# Altium project SLRC_Robot.PrjPcb (part 2 of 2)

## Sheet BuckBoost.SchDoc
size A; SheetNumber: 9; SheetTotal: 11
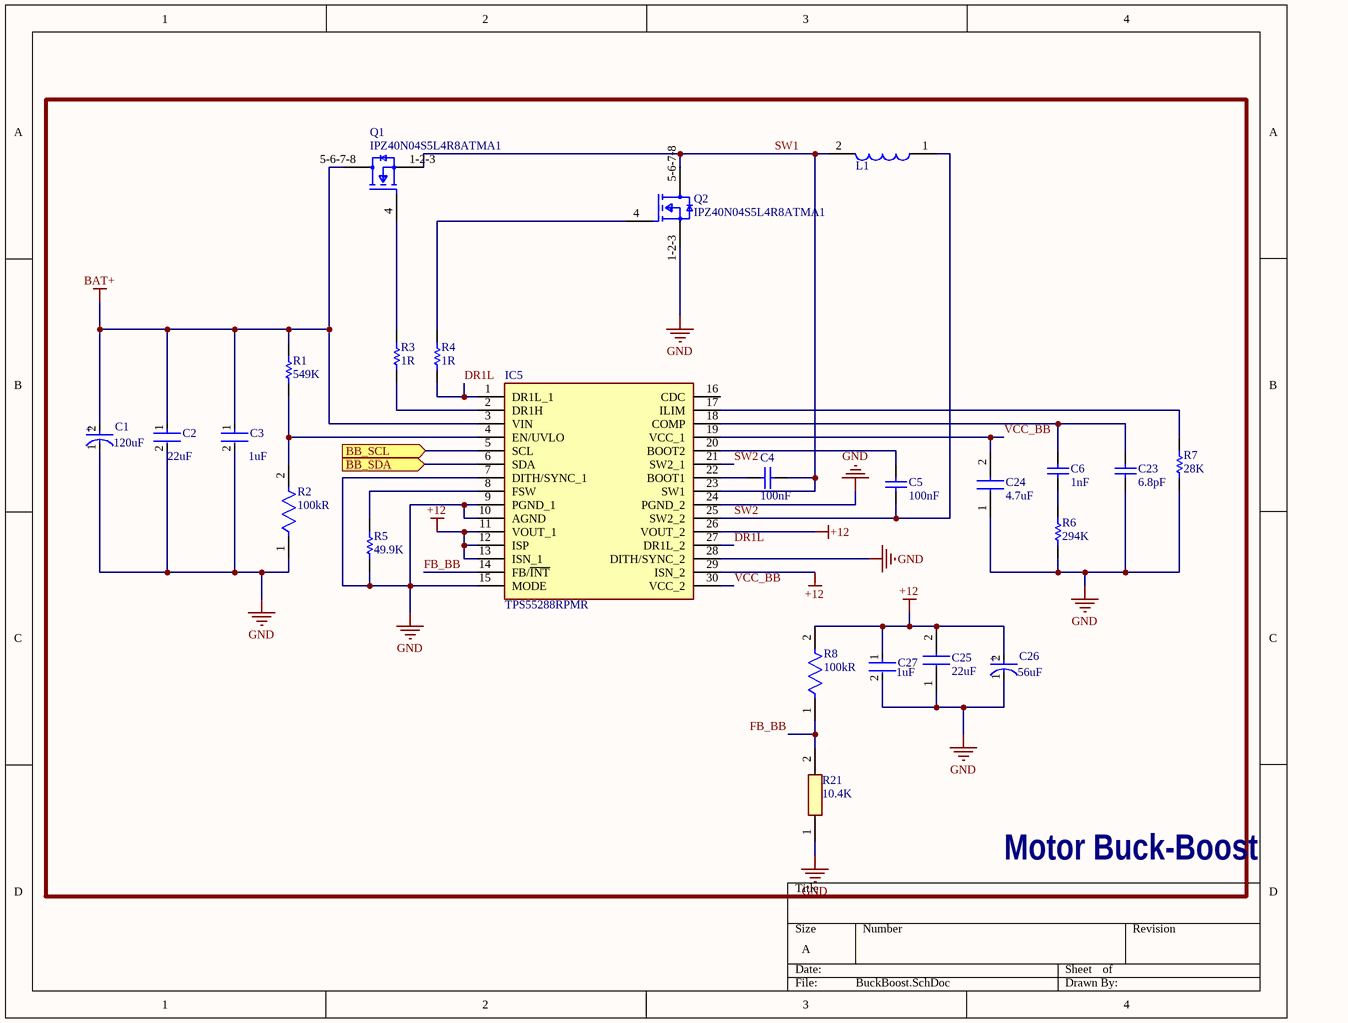
[diagram p10: BuckBoost.SchDoc]

### Parts
C1  Capacitance: 120uF  [FP-OS-CON-SMT-C6-MFG]  (hidden comment: 20SVPF120M)
C2  Capacitance: 22uF  [FP-GRM32-MFG]  (hidden comment: GRM32ER61E226KE15L)
C3  Capacitance: 1uF  [FP-C1005-050-0_05-IPC_C]  (hidden comment: C1005X5R1V105K050BC)
C4  Capacitance: 100nF  [CAPC1050X55X23ML05T13]  (hidden comment: CL05B104KO5NNNC)
C5  Capacitance: 100nF  [CAPC1050X55X23ML05T13]  (hidden comment: CL05B104KO5NNNC)
C6  capacitance: 1nF  [CAPC1005X55X25NL05T10]  (hidden comment: GRM155R71C102KA01D)
C23  capacitance: 6.8pF  [CAPC1005X55X25NL05T10]  (hidden comment: GRM1555C1E6R8CA01D)
C24  capacitance: 4.7uF  [CAPC1608X80N]  (hidden comment: C1608X6S1C475K080AC)
C25  capacitance: 22uF  [CAPC5750X280N]  (hidden comment: CGA9P2X7R1E226M250KA)
C26  Capacitance: 56uF  [FP-OS-CON-SMT-B6-MFG]  (hidden comment: 20SVPF56MX)
C27  Capacitance: 1uF  [FP-C1005-050-0_05-IPC_C]  (hidden comment: C1005X5R1V105K050BC)
IC5  TPS55288RPMR  [TPS55288RPMR]
L1  XAL6030-182MEB  [XAL6030182MEB]  (value not drawn)
Q1  IPZ40N04S5L4R8ATMA1  [FP-PG-TSDSON-8-MFG]
Q2  IPZ40N04S5L4R8ATMA1  [FP-PG-TSDSON-8-MFG]
R1  resistance: 549K  [RESC1005X40X25LL05T05]  (hidden comment: CRCW0402549KFKED)
R2  Resistance: 100kR  [FP-CRCW0402-e3-IPC_C]  (hidden comment: CRCW0402100KFKED)
R3  resistance: 1R  [RESC1609X50X30NL10T20]  (hidden comment: CRCW06031R00FKEA)
R4  resistance: 1R  [RESC1609X50X30NL10T20]  (hidden comment: CRCW06031R00FKEA)
R5  resistance: 49.9K  [RESC1005X40X25LL05T05]  (hidden comment: CRCW040249K9FKED)
R6  resistance: 294K  [RESC1005X40X25LL05T05]  (hidden comment: CRCW0402294KFKED)
R7  resistance: 28K  [RESC1005X40X25NL05T05]  (hidden comment: CRCW040228K0FKED)
R8  Resistance: 100kR  [FP-CRCW0402-e3-IPC_C]  (hidden comment: CRCW0402100KFKED)
R21  resistance: 10.4K  [RESC2012X60N]  (hidden comment: RT0805BRD0710K4L)

### Blocks framed on the sheet
Motor Buck-Boost: C1-C6 C23-C27 IC5 L1 Q1 Q2 R1-R8 R21

### Ports
BB_SCL (in, see Power[2A]), BB_SDA (in, see Power[2A])

### Nets
+12: C25.2 C26.2(A) C27.1 IC5.11(VOUT_1) IC5.12(ISP) IC5.13(ISN_1) IC5.26(VOUT_2) IC5.29(ISN_2) R8.2
BAT+: C1.2(A) C2.1 C3.1 IC5.3(VIN) Q1.5-6-7-8(D) R1.2
GND: C1.1(C) C2.2 C3.2 C23.1 C24.1 C25.1 C26.1(C) C27.2 IC5.7(DITH/SYNC_1) IC5.9(PGND_1) IC5.10(AGND) IC5.15(MODE) IC5.24(PGND_2) IC5.28(DITH/SYNC_2) Q2.1-2-3(S) R2.1 R5.1 R6.1 R7.1 R21.1
DR1L: IC5.1(DR1L_1) IC5.27(DR1L_2) R4.1
FB_BB: IC5.14(FB/~{INT}) R8.1 R21.2
MCU_SCL_1: IC5.5(SCL) ; port BB_SCL
MCU_SDA_1: IC5.6(SDA) ; port BB_SDA
SW1: C4.1 IC5.23(SW1) L1.2 Q1.1-2-3(S) Q2.5-6-7-8(D)
SW2: C5.2 IC5.21(SW2_1) IC5.25(SW2_2) L1.1
VCC_BB: C24.2 IC5.19(VCC_1) IC5.30(VCC_2)
NetC4_2: C4.2 IC5.22(BOOT1)
NetC5_1: C5.1 IC5.20(BOOT2)
NetC6_1: C6.1 R6.2
NetC6_2: C6.2 C23.2 IC5.18(COMP)
NetIC5_2: IC5.2(DR1H) R3.1
NetIC5_4: IC5.4(EN/UVLO) R1.1 R2.2
NetIC5_8: IC5.8(FSW) R5.2
NetIC5_17: IC5.17(ILIM) R7.2
NetQ1_4: Q1.4(G) R3.2
NetQ2_4: Q2.4(G) R4.2

Not connected (* = marked no-connect by the designer): IC5 16(CDC)

### Notes on the sheet
- (in symbol CMP-05428-001086-1) +
- (in symbol CMP-05428-001333-1) +

### Library data of the parts
C1 = CMP-05428-001333-1: Conductive Polymer Aluminum Solid Capacitors (OS-CON) 120uF ±20% 20V; Polarity: Polar; ESR (Equivalent Series Resistance): 25mR; Leakage Current: 480uA; Ripple Current: 3.2A; Life (Hours): 5000Hour; Dissipation Factor: 12%; Lead Free: Lead Free; Voltage Rating: 20V; Packaging: Tape and Reel; Min Operating Temperature: -55°C; Tolerance: 20%; Diameter: 6.3mm; Max Operating Temperature: 105°C; Length: 5.9mm; Termination: SMD/SMT; Height - Seated (Max): 0.236inch; REACH SVHC: No SVHC; Voltage Rating (DC): 20V; Voltage: 20V; Material: Polymer; Ripple Current (AC): 3.2A; Series: OS-CON™, SVPF; RoHS Compliant: Yes; Mount: Surface Mount; Height: 5.9mm; Package Quantity: 1000; Radiation Hardening: No; Construction: Cylindrical; Case/Package: Radial; Number of Pins: 6
C2 = CMP-2000-05458-2: CAP CER 22UF 25V X5R 1210; Manufacturer: Murata Electronics North America; Possible Substitute: GRM32ER61E226KE15K; Other Names: 490-3889-2; Material: Ceramic; Tolerance: 10%; Digikey Description: CAP CER 22UF 25V X5R 1210; Mouser Description: Multilayer Ceramic Capacitors MLCC - SMD/SMT 1210 22uF 25volts X5R 10%; Device Class L2: Capacitors; Height: 2.7mm; Temperature Characteristic: X5R; Category: Cap; RoHS: TRUE; Operating Temperature: -55°C ~ 85°C; Temperature: -55°C to +85°C; Lead Free: Yes; Package: GRM32; Temperature Range High: +85°C; Package / Case: 1210 (3225 Metric); Standard Package: 1,000; Packaging: Cut Tape (CT); Thickness (Max): 0.106" (2.70mm); Value: 22uF; Automotive: No; Device Class L1: Passive Components; Voltage - Rated: 25V; Temperature Range Low: -55°C; Size / Dimension: 0.126" L x 0.098" W (3.20mm x 2.50mm); ComponentLink2Description: Datasheet; Device Class L3: Ceramic Capacitors; Temperature Coefficient: X5R; ComponentLink2URL: https://search.murata.co.jp/Ceramy/image/img/A01X/G101/ENG/GRM32ER61E226KE15-01A.pdf; Voltage Rating: 25V; Manufacturer Part Number: GRM32ER61E226KE15L; Octopart: https://octopart.com/grm32er61e226ke15l-murata-197441; Applications: General Purpose; Mounting Type: Surface Mount, MLCC
C3 C27 = CMP-2000-06004-2: Multilayer Ceramic Capacitors 1μF ±10% 35V X5R SMD 0402; Series: C; Voltage Rating (DC): 35V; Max Operating Temperature: 85°C; Resistor Type: Ceramic; REACH SVHC: No SVHC; Package Quantity: 1; Packaging: Tape and Reel; Termination: SMD/SMT; Dielectric Material: Ceramic; Height: 0.5mm; Length: 1mm; Min Operating Temperature: -55°C; Dielectric: X5R; Thickness: 0.022inch; Lead Free: Lead Free; Voltage Rating: 35V; Width: 0.02inch; Depth: 0.5mm; Case Code (Imperial): 0402; Case/Package: 0402; Tolerance: 10%; Weight: 2.3E-05oz; Radiation Hardening: No; RoHS Compliant: Yes; Case Code (Metric): 1005; Mount: Surface Mount
C4 C5 = CMP-2000-05439-1: Chip Capacitor, 100 nF, +/- 10%, 16 V, -55 to 125 degC, 0402 (1005 Metric), RoHS, Tape and Reel; Manufacturer: Samsung Electro-Mechanics; Dielectric: X7R; Rated Voltage: 16V; Case Size/Dimension: 0402; Tolerance (%): ±10%; Manufacturer URL: http://www.samsungsem.com/global/index.jsp; Datasheet URL: https://datasheet.ciiva.com/29198/458718-da-01-en-vs-kondensator-0402-29198423.pdf; Datasheet Version: Nov-10
C6 = CMP-2008-03949-1: Manufacturer: Murata; Part Number: GRM155R71C102KA01D
C23 = CMP-2008-04219-1: Manufacturer: Murata; Part Number: GRM1555C1E6R8CA01D
C24 = C1608X6S1C475K080AC: Capacitor; Manufacturer_Name: TDK; Datasheet Link: https://product.tdk.com/info/en/catalog/datasheets/mlcc_commercial_midvoltage_en.pdf; Height: 0.8mm; Manufacturer_Part_Number: C1608X6S1C475K080AC; Mouser Part Number: 810-C1608X6S1C475K; Mouser Price/Stock: https://www.mouser.co.uk/ProductDetail/TDK/C1608X6S1C475K080AC?qs=dfay7wIA1uELNO4%252B8xvBDw%3D%3D; Arrow Part Number: C1608X6S1C475K080AC; Arrow Price/Stock: https://www.arrow.com/en/products/c1608x6s1c475k080ac/tdk?region=nac
C25 = CGA9P2X7R1E226M250KA: Capacitor; Manufacturer_Name: TDK; Datasheet Link: https://product.tdk.com/system/files/dam/doc/product/capacitor/ceramic/mlcc/catalog/mlcc_automotive_general_en.pdf; Height: 2.8mm; Manufacturer_Part_Number: CGA9P2X7R1E226M250KA; Mouser Part Number: 810-CGA9P2X7R1E226M; Mouser Price/Stock: https://www.mouser.co.uk/ProductDetail/TDK/CGA9P2X7R1E226M250KA?qs=NRhsANhppD99aYOe83Ouyg%3D%3D; Arrow Part Number: CGA9P2X7R1E226M250KA; Arrow Price/Stock: https://www.arrow.com/en/products/cga9p2x7r1e226m250ka/tdk?region=nac
C26 = CMP-05428-001086-1: Conductive Polymer Aluminum Solid Capacitors (OS-CON) 56uF ±20% 20V; Ripple Current (AC): 2.8A; Polarity: Polar; ESR (Equivalent Series Resistance): 30mR; Life (Hours): 5000Hour; Dissipation Factor: 12%; Leakage Current: 224uA; Case/Package: Radial; Mount: Surface Mount; Tolerance: 20%; Termination: SMD/SMT; Length: 5.9mm; RoHS Compliant: Yes; Height - Seated (Max): 0.236inch; Ripple Current: 2.8A; Voltage Rating (DC): 20V; Packaging: Tape and Reel; REACH SVHC: No SVHC; Voltage: 20V; Min Operating Temperature: -55°C; Height: 5.9mm; Series: OS-CON™, SVPF; Package Quantity: 1500; Max Operating Temperature: 105°C; Voltage Rating: 20V; Diameter: 5mm; Number of Pins: 6
IC5 = TPS55288RPMR: Integrated Circuit; Manufacturer_Name: Texas Instruments; Datasheet Link: https://www.ti.com/lit/ds/symlink/tps55288.pdf; Height: 1mm; Manufacturer_Part_Number: TPS55288RPMR; Mouser Part Number: 595-TPS55288RPMR; Mouser Price/Stock: https://www.mouser.co.uk/ProductDetail/Texas-Instruments/TPS55288RPMR?qs=bAKSY%2FctAC57bSsN8PUBnQ%3D%3D; Arrow Part Number: TPS55288RPMR; Arrow Price/Stock: https://www.arrow.com/en/products/tps55288rpmr/texas-instruments?region=nac
L1 = XAL6030-182MEB: Inductor; Manufacturer_Name: COILCRAFT; Datasheet Link: https://www.coilcraft.com/pdfs/xal60xx.pdf; Height: 3.1mm; Manufacturer_Part_Number: XAL6030-182MEB; Mouser Part Number: 994-XAL6030-182MEB; Mouser Price/Stock: https://www.mouser.co.uk/ProductDetail/Coilcraft/XAL6030-182MEB?qs=VJjuEbE9QBNl9%2F4O4ZhQvg%3D%3D
Q1 Q2 = CMP-32901-000690-1: MOSFET N-CH 40V 40A 8TSDSON; Max Power Dissipation: 48W; Rds On Max: 4.8mR; Input Capacitance: 1.56nF; Packaging: Tape and Reel; Max Operating Temperature: 175°C; Max Dual Supply Voltage: 40V; Min Operating Temperature: -55°C; Continuous Drain Current (ID): 40A; Number of Pins: 8; Halogen Free: Halogen Free; Lead Free: Contains Lead; Series: Automotive, AEC-Q101, OptiMOS™; Drain to Source Voltage (Vdss): 40V; RoHS Compliant: Yes; Mount: Surface Mount
R1 = CMP-2002-00092-1: Manufacturer: Vishay Dale; Part Number: CRCW0402549KFKED
R2 R8 = CMP-2002-08123-3: RES Thick Film, 100kΩ, 1%, 0.063W, 100ppm/°C, 0402; Power Rating: 63mW; Voltage Rating (DC): 50V; Lead Free: Lead Free; Height: 0.35mm; Contact Plating: Tin; Min Operating Temperature: -55°C; Package Quantity: 10000; Case/Package: 0402; Temperature Coefficient: 100ppm/°C; Number of Terminations: 2; Packaging: Tape and Reel; Max Power Dissipation: 63mW; Case Code (Metric): 1005; Mount: Surface Mount; Width: 0.02inch; Termination: SMD/SMT; Length: 1mm; Number of Pins: 2; Weight: 2.3E-05oz; Radiation Hardening: No; Tolerance: 1%; Military Standard: Not; Features: Automotive AEC-Q200; Depth: 0.5mm; Composition: Thick Film; Max Operating Temperature: 155°C; Voltage Rating: 50V; Case Code (Imperial): 0402
R3 R4 = CMP-1012-00171-2: Manufacturer: Vishay Dale; Part Number: CRCW06031R00FKEA
R5 = CMP-2002-00039-1: Manufacturer: Vishay Dale; Part Number: CRCW040249K9FKED
R6 = CMP-2002-08443-1: Manufacturer: Vishay Dale; Part Number: CRCW0402294KFKED
R7 = CMP-2002-08441-1: Manufacturer: Vishay Dale; Part Number: CRCW040228K0FKED
R21 = RT0805BRD0710K4L: Resistor; Manufacturer_Name: KEMET; Datasheet Link: https://www.arrow.com/en/products/rt0805brd0710k4l/yageo; Height: 0.6mm; Manufacturer_Part_Number: RT0805BRD0710K4L; Mouser Part Number: 603-RT0805BRD0710K4L; Mouser Price/Stock: https://www.mouser.co.uk/ProductDetail/Yageo/RT0805BRD0710K4L?qs=MIKj0bPR1zBRjPJ4x5pJ2A%3D%3D; Arrow Part Number: RT0805BRD0710K4L; Arrow Price/Stock: https://www.arrow.com/en/products/rt0805brd0710k4l/yageo

## Sheet 3.3V_LDO.SchDoc
size A; SheetNumber: 11; SheetTotal: 11
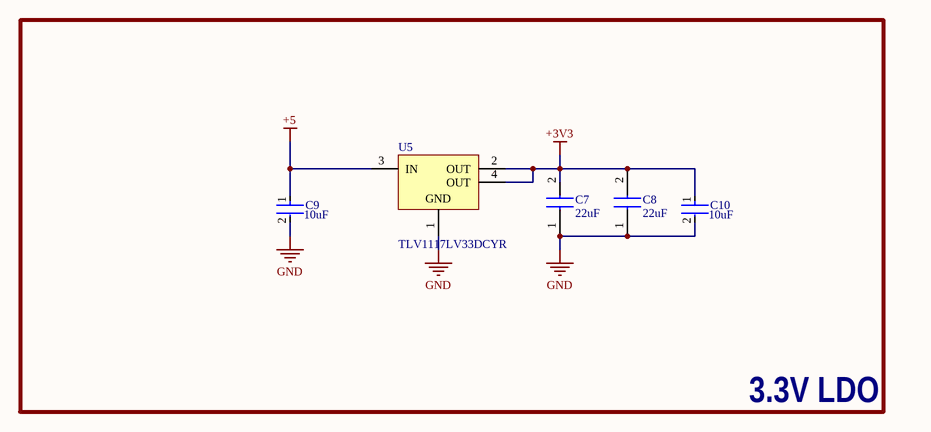
[diagram p11: 3.3V_LDO.SchDoc]

### Parts
C7  value 22uF  [CAPC1608X105N]  (hidden comment: CL10A226MP8NUNE)
C8  value 22uF  [CAPC1608X105N]  (hidden comment: CL10A226MP8NUNE)
C9  Capacitance: 10uF  [FP-CL05A106MP5NUNC-MFG]  (hidden comment: CL05A106MP5NUNC)
C10  Capacitance: 10uF  [FP-CL05A106MP5NUNC-MFG]  (hidden comment: CL05A106MP5NUNC)
U5  TLV1117LV33DCYR  [DCY0004A_N]

### Blocks framed on the sheet
3.3V LDO: C7-C10 U5

### Nets
+3V3: C7.2 C8.2 C10.1 U5.2(OUT) U5.4(OUT)
+5: C9.1 U5.3(IN)
GND: C7.1 C8.1 C9.2 C10.2 U5.1(GND)

### Library data of the parts
C7 C8 = CL10A226MP8NUNE: Capacitor; Manufacturer_Name: SAMSUNG; Datasheet Link: https://datasheet.datasheetarchive.com/originals/distributors/Datasheets-DGA10/2407063.pdf; Height: 1.05mm; Manufacturer_Part_Number: CL10A226MP8NUNE; Mouser Part Number: 187-CL10A226MP8NUNE; Mouser Price/Stock: https://www.mouser.co.uk/ProductDetail/Samsung-Electro-Mechanics/CL10A226MP8NUNE?qs=gRKWieUq2Hb5O0PTfRKzDQ%3D%3D; Arrow Part Number: CL10A226MP8NUNE; Arrow Price/Stock: https://www.arrow.com/en/products/cl10a226mp8nune/samsung-electro-mechanics?region=nac; Supplier 1: Mouser; Supplier Part Number 1: 187-CL10A226MP8NUNE
C9 C10 = CMP-13271-000002-1: CAP CER 10UF 10V X5R 0402; Manufacturer: Samsung; Temperature Coefficient: 15%; Tolerance: 20%; Material: Ceramic; Octopart: https://octopart.com/cl05a106mp5nunc-samsung-22457395; Voltage Rating: 10V; RoHS: TRUE; Value: 10uF; Height: 0.7mm; Digikey Description: CAP CER 10UF 10V X5R 0402; Automotive: No; Package: CL05A106MP5NUNC; Device Class L1: Passive Components; Temperature Range High: +85°C; ComponentLink2Description: Datasheet; Device Class L2: Capacitors; Temperature Characteristic: X5R; Manufacturer Part Number: CL05A106MP5NUNC; Temperature: -55°C to +85°C; ComponentLink2URL: http://www.samsungsem.com/kr/support/product-search/mlcc/__icsFiles/afieldfile/2019/05/10/19-CL05A106MP5NUNC.pdf; Device Class L3: Ceramic Capacitors; Category: Cap; Temperature Range Low: -55°C; Ipc Land Pattern Name: CAPC10050X50; Lead Free: Yes
U5 = CMP-0395-00503-2: Single Output LDO, 1 A, Fixed 3.3 V Output, 2 to 5.5 V Input, 4-pin SOT-223 (DCY), -40 to 125 degC, Green (RoHS & no Sb/Br); Manufacturer: Texas Instruments; Vout Adj(Min)(V): 3.3; Vdo(Typ)(mV): 1200; Iq(Typ)(mA): 0.05; Accuracy(%): 2; Iout(Max)(A): 1; SubFamily: Single Channel LDO; Vin(Max)(V): 5.5; PackageReference: DCY0004A; PackageDescription: 4-Pin Plastic Small Outline, Body 3.5 x 6.5 mm, Pitch 2.3 mm; Vout Adj(Max)(V): 3.3; Mounting Technology: Surface Mount; ComponentLink2Description: Datasheet; ComponentLink1Description: Manufacturer URL; PartNumber: TLV1117LV33DCYR; ComponentLink3Description: Package Specification; ComponentLink1URL: http://www.ti.com/; ComponentLink2URL: http://www.ti.com/general/docs/lit/getliterature.tsp?genericPartNumber=TLV1117LV33&fileType=pdf; Fixed Output Options(V): 3.3; PackageVersion: 4202506/B; Vin(Min)(V): 2; DatasheetVersion: SBVS160A; Eco-Plan: Green (RoHS & no Sb/Br); ComponentLink3URL: http://www.ti.com/litv/pdf/mpds094a; Code_JEDEC: TO-261

## Nets that join several sheets
+3V3: MicroController (41 pins), MotorController (J20.3 J20.7), Shooter (IC6.8), FrontIrArray (7 pins), RrIrArray (C50.1 IC3.24 P3.19), IMU Unit (C17.1 C19.2 U3.8 U3.13), 3.3V_LDO (5 pins)
+5: MicroController (6 pins), MotorController (J20.10 J22.3 J24.3), BuckConverter (7 pins), 3.3V_LDO (C9.1 U5.3)
+12: MicroController (J4.1), MotorController (J21.2), Shooter (C14.1 C15.2 C49.2 IC6.1), BuckBoost (9 pins)
BAT+: Power (J19.1 R15.2), BuckConverter (7 pins), BuckBoost (6 pins)
GND: MicroController (51 pins), MotorController (5 pins), Shooter (7 pins), FrontIrArray (10 pins), RrIrArray (C50.2 IC3.12 IC3.15 P3.21), IMU Unit (8 pins), Power (J19.2 R16.1), BuckConverter (15 pins), BuckBoost (20 pins), 3.3V_LDO (5 pins)
MCU_SCL_1: MicroController (10 pins), IMU Unit (U3.23), BuckBoost (IC5.5)
MCU_SDA_1: MicroController (10 pins), IMU Unit (U3.24), BuckBoost (IC5.6)
NetIC1_1: MicroController (U1.15), FrontIrArray (IC1.1)
NetIC1_10: MicroController (U1.85), FrontIrArray (IC1.10)
NetIC1_11: MicroController (U1.86), FrontIrArray (IC1.11)
NetIC1_13: MicroController (U1.88), FrontIrArray (IC1.13)
NetIC1_14: MicroController (U1.87), FrontIrArray (IC1.14)
NetIC2_1: MicroController (U1.16), FrontIrArray (IC2.1)
NetIC2_10: MicroController (U1.83), FrontIrArray (IC2.10)
NetIC2_11: MicroController (U1.84), FrontIrArray (IC2.11)
NetIC2_13: MicroController (U1.82), FrontIrArray (IC2.13)
NetIC2_14: MicroController (U1.81), FrontIrArray (IC2.14)
NetIC3_1: MicroController (U1.35), RrIrArray (IC3.1)
NetIC3_10: MicroController (U1.36), RrIrArray (IC3.10)
NetIC3_11: MicroController (U1.37), RrIrArray (IC3.11)
NetIC3_13: MicroController (U1.39), RrIrArray (IC3.13)
NetIC3_14: MicroController (U1.38), RrIrArray (IC3.14)
NetIC6_5: MicroController (U1.25), Shooter (IC6.5 IC6.6)
NetJ20_2: MicroController (U1.42), MotorController (J20.2)
NetJ20_4: MicroController (U1.54), MotorController (J20.4)
NetJ20_5: MicroController (U1.53), MotorController (J20.5)
NetJ20_6: MicroController (U1.40), MotorController (J20.6)
NetJ20_8: MicroController (U1.52), MotorController (J20.8)
NetJ20_9: MicroController (U1.51), MotorController (J20.9)
NetJ22_5: MicroController (U1.31), MotorController (J22.5)
NetJ22_6: MicroController (U1.32), MotorController (J22.6)
NetJ24_5: MicroController (U1.23), MotorController (J24.5)
NetJ24_6: MicroController (U1.24), MotorController (J24.6)
NetP3_17: MicroController (U1.33), RrIrArray (P3.17)
NetP3_18: MicroController (U1.34), RrIrArray (P3.18)
NetP4_5: MicroController (U1.80), FrontIrArray (P4.5)
NetP4_6: MicroController (U1.77), FrontIrArray (P4.6)
NetR15_1: MicroController (U1.17), Power (R15.1 R16.2)
NetU1_5: MicroController (U1.5), IMU Unit (U3.12)